# EAGLE design EFM-VCF-4622 (EAGLE 7.2.0)
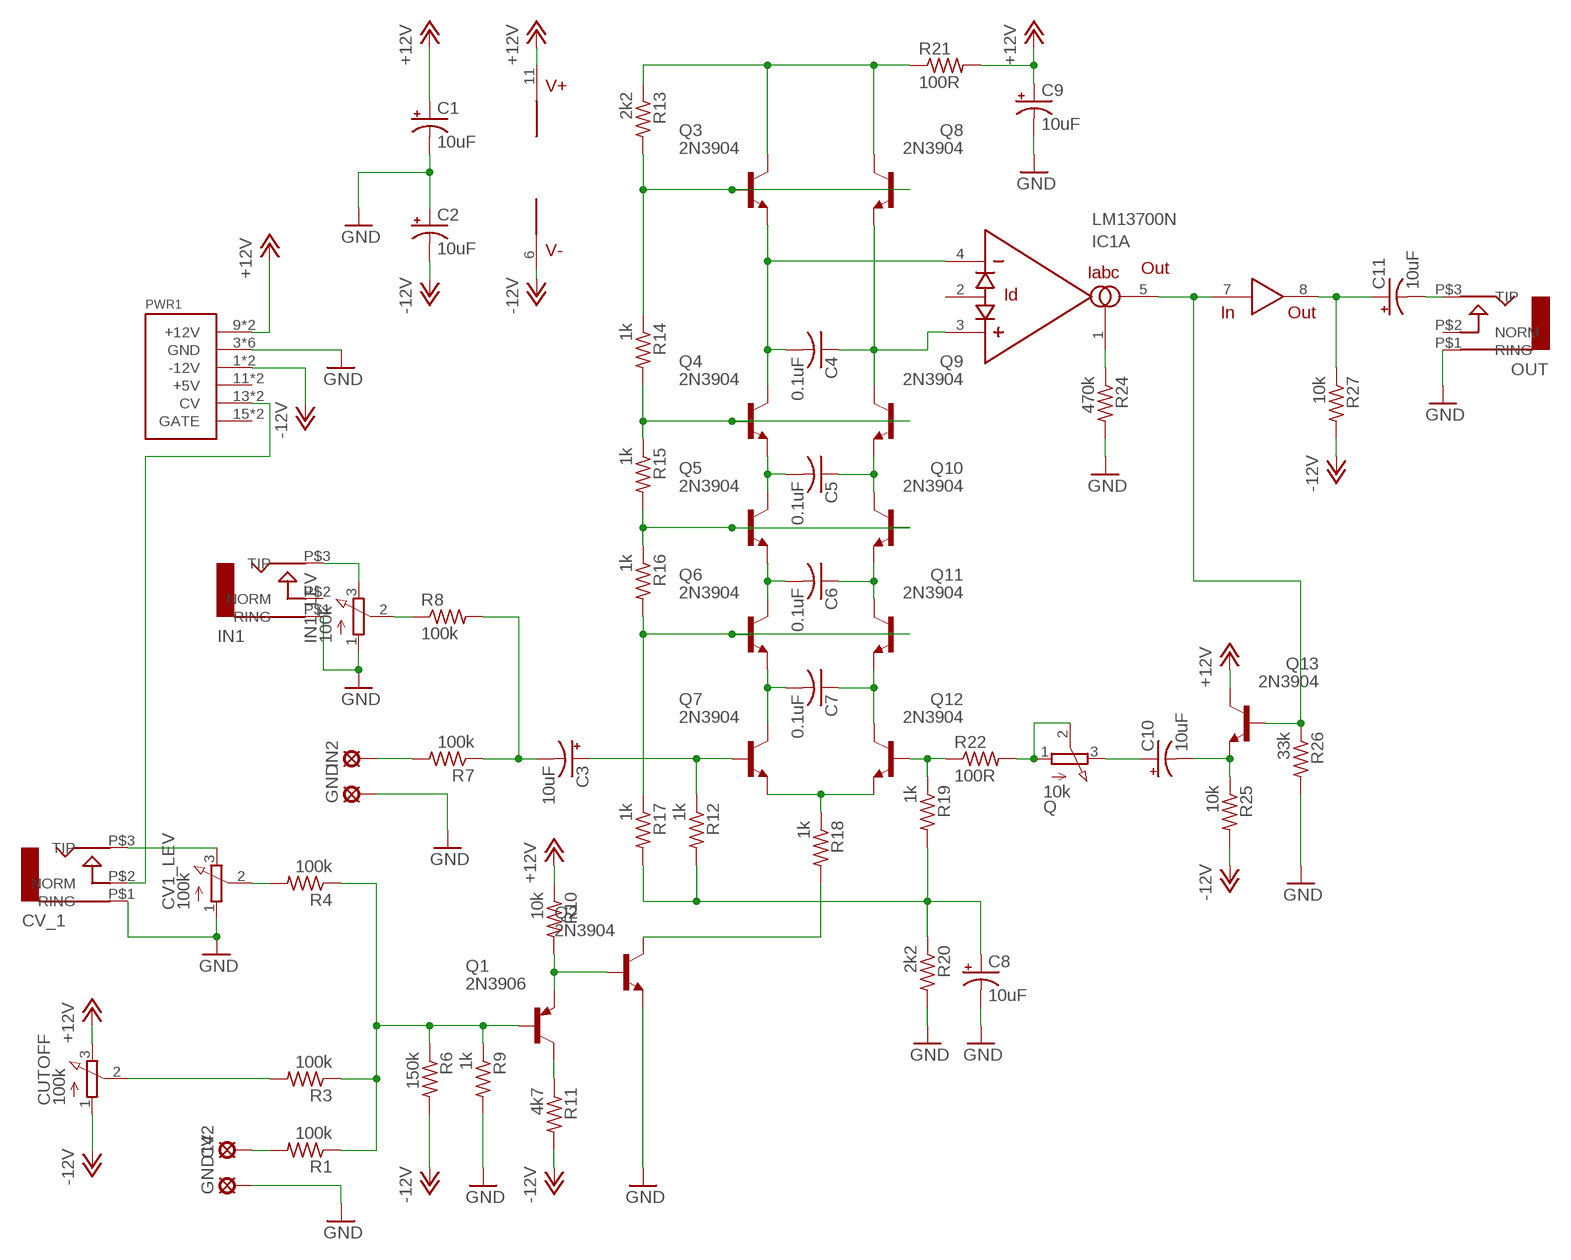
[diagram p0: schematic, sheet 1]

## Parts
C1  10uF  CPOL-USB45181A  [B45181A]
C2  10uF  CPOL-USB45181A  [B45181A]
C3  10uF  CPOL-USB45181A  [B45181A]
C4  0.1uF  C-US050-025X075  [C050-025X075]
C5  0.1uF  C-US050-025X075  [C050-025X075]
C6  0.1uF  C-US050-025X075  [C050-025X075]
C7  0.1uF  C-US050-025X075  [C050-025X075]
C8  10uF  CPOL-USB45181A  [B45181A]
C9  10uF  CPOL-USB45181A  [B45181A]
C10  10uF  CPOL-USB45181C  [B45181C]
C11  10uF  CPOL-USB45181B  [B45181B]
CUTOFF  100k  3RP/1610N  [3RP/1610N]
CV1_LEV  100k  3RP/1610N  [3RP/1610N]
CV2  LSP10  [LSP10]
CV_1  AUDIO-JACK  [ERTHENVAR-JACK-90DEG]
GND  LSP10  [LSP10]
GND14  LSP10  [LSP10]
IC1  LM13700N  [DIL16]
IN1  AUDIO-JACK  [ERTHENVAR-JACK-90DEG]
IN1_LEV  100k  3RP/1610N  [3RP/1610N]
IN2  LSP10  [LSP10]
OUT  AUDIO-JACK  [ERTHENVAR-JACK-90DEG]
PWR1  POWER  [POWER_16]
Q  10k  3RP/1610N  [3RP/1610N]
Q1  2N3906  [TO92]
Q2  2N3904  [TO92]
Q3  2N3904  [TO92]
Q4  2N3904  [TO92]
Q5  2N3904  [TO92]
Q6  2N3904  [TO92]
Q7  2N3904  [TO92]
Q8  2N3904  [TO92]
Q9  2N3904  [TO92]
Q10  2N3904  [TO92]
Q11  2N3904  [TO92]
Q12  2N3904  [TO92]
Q13  2N3904  [TO92]
R1  100k  R-US_0207/7  [0207/7]
R3  100k  R-US_0207/7  [0207/7]
R4  100k  R-US_0207/7  [0207/7]
R6  150k  R-US_0207/7  [0207/7]
R7  100k  R-US_0207/7  [0207/7]
R8  100k  R-US_0207/7  [0207/7]
R9  1k  R-US_0207/7  [0207/7]
R10  10k  R-US_0207/7  [0207/7]
R11  4k7  R-US_0207/7  [0207/7]
R12  1k  R-US_0207/7  [0207/7]
R13  2k2  R-US_0207/7  [0207/7]
R14  1k  R-US_0207/7  [0207/7]
R15  1k  R-US_0207/7  [0207/7]
R16  1k  R-US_0207/7  [0207/7]
R17  1k  R-US_0207/7  [0207/7]
R18  1k  R-US_0207/7  [0207/7]
R19  1k  R-US_0207/7  [0207/7]
R20  2k2  R-US_0207/7  [0207/7]
R21  100R  R-US_0207/7  [0207/7]
R22  100R  R-US_0207/7  [0207/7]
R24  470k  R-US_0207/7  [0207/7]
R25  10k  R-US_0207/7  [0207/7]
R26  33k  R-US_0207/7  [0207/7]
R27  10k  R-US_0207/7  [0207/7]

## Nets
+12V: C1.+ C9.+ CUTOFF.3(E) IC1.11(5:V+) PWR1.9(+12V) PWR1.10(+12V) Q13.1(C) R10.1 R21.2
-12V: C2.- CUTOFF.1(A) IC1.6(5:V-) PWR1.1(-12V) PWR1.2(-12V) R6.2 R11.2 R25.2 R27.2
GND: C1.- C2.+ C8.- C9.- CV1_LEV.1(A) CV_1.P$1(RING) GND14.MP GND.MP IN1.P$1(RING) IN1_LEV.1(A) OUT.P$1(RING) PWR1.3(GND) PWR1.4(GND) PWR1.5(GND) PWR1.6(GND) PWR1.7(GND) PWR1.8(GND) Q2.3(E) R9.2 R20.2 R24.2 R26.2
N$1: IC1.1(A:IABC) R24.1
N$2: Q.1(A) Q.2(S) R22.2
N$3: Q2.1(C) R18.2
N$4: Q7.3(E) Q12.3(E) R18.1
N$5: IN2.MP R7.2
N$6: C3.- R7.1 R8.2
N$7: C3.+ Q7.2(B) R12.1
N$8: Q1.3(E) Q2.2(B) R10.2
N$9: C4.2 IC1.4(A:-IN) Q3.3(E) Q4.1(C)
N$10: C10.+ Q.3(E)
N$11: CV2.MP R1.2
N$12: C4.1 IC1.3(A:+IN) Q8.3(E) Q9.1(C)
N$13: C6.1 Q10.3(E) Q11.1(C)
N$14: C5.2 Q4.3(E) Q5.1(C)
N$15: C5.1 Q9.3(E) Q10.1(C)
N$17: C7.1 Q11.3(E) Q12.1(C)
N$18: C7.2 Q6.3(E) Q7.1(C)
N$19: IC1.5(A:OUT) IC1.7(3:IN) Q13.2(B) R26.1
N$20: Q1.2(B) R1.1 R3.1 R4.1 R6.1 R9.1
N$25: C8.+ R12.2 R17.2 R19.2 R20.1
N$26: Q12.2(B) R19.1 R22.1
N$27: Q1.1(C) R11.1
N$28: C11.+ IC1.8(3:OUT) R27.1
N$29: C6.2 Q5.3(E) Q6.1(C)
N$31: C11.- OUT.P$3(TIP)
N$35: C10.- Q13.3(E) R25.1
N$43: Q3.1(C) Q8.1(C) R13.1 R21.1
N$44: Q3.2(B) Q8.2(B) R13.2 R14.1
N$46: Q4.2(B) Q9.2(B) R14.2 R15.1
N$49: Q5.2(B) Q10.2(B) R15.2 R16.1
N$50: Q6.2(B) Q11.2(B) R16.2 R17.1
N$53: CV1_LEV.2(S) R4.2
N$55: CV_1.P$2(NORM) PWR1.13(CV) PWR1.14(CV)
N$56: CUTOFF.2(S) R3.2
N$57: IN1_LEV.2(S) R8.1
N$58: IN1.P$3(TIP) IN1_LEV.3(E)
N$59: CV1_LEV.3(E) CV_1.P$3(TIP)
Unconnected: IC1.2(A:ID) IC1.9(4:OUT) IC1.10(4:IN) IC1.12(B:OUT) IC1.13(B:-IN) IC1.14(B:+IN) IC1.15(B:ID) IC1.16(B:IABC) IN1.P$2(NORM) OUT.P$2(NORM) PWR1.11(+5V) PWR1.12(+5V) PWR1.15(GATE) PWR1.16(GATE)

## Library data of the parts
C1-C3 C8-C11 = rcl:CPOL-US: POLARIZED CAPACITOR, American symbol
C4-C7 = rcl:C-US: CAPACITOR, American symbol
CUTOFF CV1_LEV IN1_LEV Q = pot:3RP/1610N: 16mm Potentiometer one level Source: http://www.alphapotentiometers.net/html/16mm_pot_2.html
CV2 GND GND14 IN2 = solpad:LSP10: SOLDER PAD drill 1.0 mm, distributor Buerklin, 12H555
CV_1 IN1 OUT = erthenvar:AUDIO-JACK: Switching Mono 3.5mm Audio Jack from Erthenvar.
IC1 = synthdiy updated imperial:LM13700: National Dual OTA with buffers.
PWR1 = eurorack:POWER
Q1 = transistor-pnp:2N3906: PNP Transistor
Q2-Q13 = transistor-npn:2N3904: NPN Transistor
R1 R3 R4 R6-R22 R24-R27 = rcl:R-US_: RESISTOR, American symbol

## Board
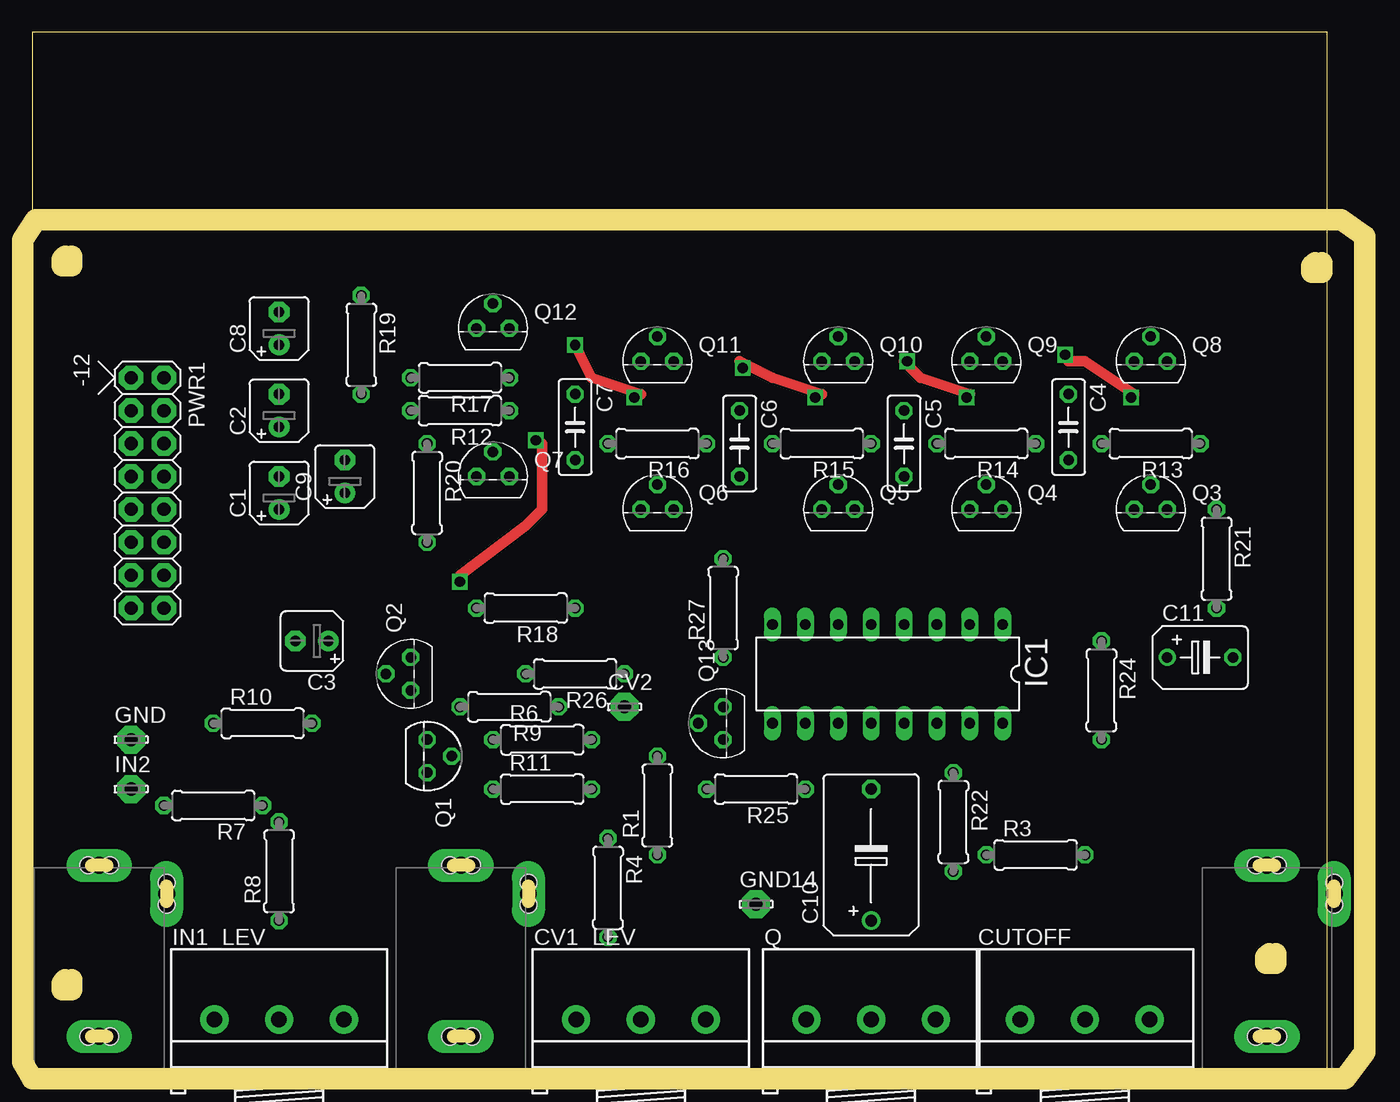
[diagram p1: board, top side]
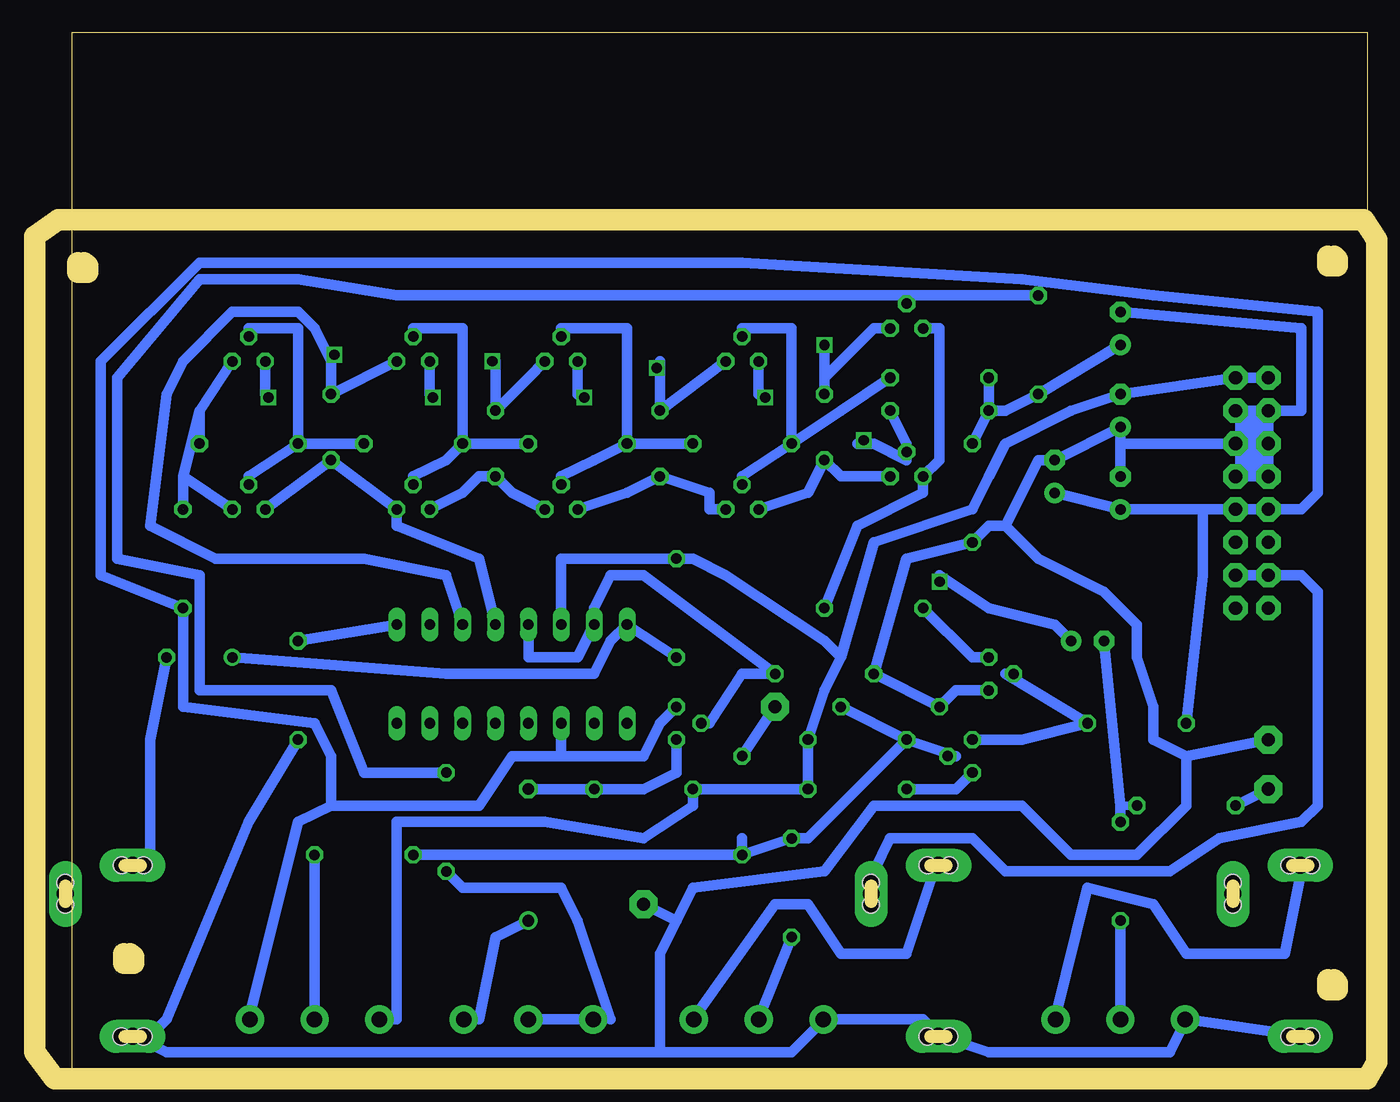
[diagram p2: board, bottom side, seen from below]

Size 100 x 80 mm. Coordinates in mm from the lower left corner, seen from the top.
Outline: 0,0 100,0 100,80 0,80 0,0
Copper layers (1*16): Top 0.035mm / dielectric 1.5mm / Bottom 0.035mm
Design rules "default *": minimum track width 26mil, minimum drill 31mil, track to track 16mil, track to pad 16mil, pad to pad 16mil, via to via 16mil, smd to smd 8mil, copper to edge 0mil, drill to drill 12mil, minimum pad ring 10mil, minimum via ring 8mil, stop-mask expansion 4mil, vias tented up to drill 0mil, thermal gap 10mil
Milling: 24 lines

### Footprints (pad centres in the part's own frame; a part is rotated, then mirrored left to right if it is on the bottom)
B45181A = drill 0.813 pad 1.6: + -1.27,0 | drill 0.813 pad 1.6 octagon: - 1.27,0
C050-025X075 = drill 0.813 octagon: 1 -2.54,0; 2 2.54,0
B45181C = drill 0.914: + -5.08,0 | drill 0.914 octagon: - 5.08,0
B45181B = drill 0.813: + -2.54,0 | drill 0.813 octagon: - 2.54,0
3RP/1610N = drill 1.2 pad 2.184: 1 -5,0; 2 0,0; 3 5,0
LSP10 = drill 1.016 pad 2.159 octagon: MP 0,0
ERTHENVAR-JACK-90DEG = drill 1.3 pad 2.54 long: P$1 5,-2.5; P$2 -0.2,-13.5; P$3 5,-15.7 | hole 1.3: 5.842,-2.489; 4.14,-2.489; -0.203,-12.649; -0.203,-14.351; 5.842,-15.697; 4.166,-15.697
DIL16 = drill 0.813 long: 1 -8.89,-3.81; 2 -6.35,-3.81; 3 -3.81,-3.81; 4 -1.27,-3.81; 5 1.27,-3.81; 6 3.81,-3.81; 7 6.35,-3.81; 8 8.89,-3.81; 9 8.89,3.81; 10 6.35,3.81; 11 3.81,3.81; 12 1.27,3.81; 13 -1.27,3.81; 14 -3.81,3.81; 15 -6.35,3.81; 16 -8.89,3.81
POWER_16 = drill 1.016 pad 1.88 octagon: 1 -6.35,-1.27; 2 -6.35,1.27; 3 -3.81,-1.27; 4 -3.81,1.27; 5 -1.27,-1.27; 6 -1.27,1.27; 7 1.27,-1.27; 8 1.27,1.27; 9 3.81,-1.27; 10 3.81,1.27; 11 6.35,-1.27; 12 6.35,1.27; 13 8.89,-1.27; 14 8.89,1.27; 15 11.43,-1.27; 16 11.43,1.27
TO92 = drill 0.813 octagon: 1 1.27,0; 2 0,1.905; 3 -1.27,0
0207/7 = drill 0.813 octagon: 1 -3.81,0; 2 3.81,0

### Placement (x,y rotation side)
C1  19.05,44.45 90 top
C2  19.05,50.8 90 top
C3  21.59,33.02 180 top
C4  80.01,49.53 270 top
C5  67.31,48.26 270 top
C6  54.61,48.26 270 top
C7  41.91,49.53 270 top
C8  19.05,57.15 90 top
C9  24.13,45.72 90 top
C10  64.77,16.51 90 top
C11  90.17,31.75 0 top
CUTOFF  81.28,3.81 0 top
CV1_LEV  46.99,3.81 0 top
CV2  45.72,27.94 0 top
CV_1  38.1,0 180 top
GND  7.62,25.4 0 top
GND14  55.88,12.7 0 top
IC1  66.04,30.48 180 top
IN1  10.16,0 180 top
IN1_LEV  19.05,3.81 0 top
IN2  7.62,21.59 0 top
OUT  100.33,0 180 top
PWR1  8.89,46.99 270 top
Q  64.77,3.81 0 top
Q1  30.48,24.13 270 top
Q2  29.21,30.48 90 top
Q3  86.36,43.18 0 top
Q4  73.66,43.18 0 top
Q5  62.23,43.18 0 top
Q6  48.26,43.18 0 top
Q7  35.56,45.72 0 top
Q8  86.36,54.61 0 top
Q9  73.66,54.61 0 top
Q10  62.23,54.61 0 top
Q11  48.26,54.61 0 top
Q12  35.56,57.15 0 top
Q13  53.34,26.67 90 top
R1  48.26,20.32 90 top
R3  77.47,16.51 0 top
R4  44.45,13.97 270 top
R6  39.37,25.4 0 top
R7  13.97,20.32 180 top
R8  19.05,15.24 90 top
R9  36.83,27.94 180 top
R10  17.78,26.67 0 top
R11  39.37,21.59 0 top
R12  33.02,50.8 180 top
R13  86.36,48.26 180 top
R14  73.66,48.26 180 top
R15  60.96,48.26 180 top
R16  48.26,48.26 180 top
R17  33.02,53.34 180 top
R18  38.1,35.56 180 top
R19  25.4,55.88 270 top
R20  30.48,44.45 270 top
R21  91.44,39.37 270 top
R22  71.12,19.05 270 top
R24  82.55,29.21 270 top
R25  55.88,21.59 180 top
R26  41.91,30.48 180 top
R27  53.34,35.56 90 top

### Tracks (layer width: path | path; a pad name or v marks a point on that pad's centre or on a via)
+12V
  Bottom 0.813: 12.7,43.18 PWR1.10 PWR1.9 5.08,43.18 3.81,44.45 3.81,58.42 16.51,59.69 26.67,60.96 48.26,62.23 90.17,62.23 97.79,54.61 97.79,38.1 R21.2 91.44,27.94 81.28,26.67 80.01,24.13 80.01,20.32 | 12.7,43.18 12.7,38.1 R10.1 | 12.7,43.18 C1.+ C9.+ | 86.36,3.81 82.55,19.05 80.01,20.32 | 80.01,20.32 77.47,20.32 73.66,20.32 71.12,20.32 68.58,20.32 66.04,24.13 62.23,24.13 | 62.23,24.13 IC1.11 | Q13.1 54.61,26.67 55.88,24.13 62.23,24.13
-12V
  Bottom 0.813: PWR1.1 PWR1.2 C2.- 22.86,50.8 27.94,48.26 29.21,45.72 30.48,43.18 38.1,40.64 40.64,31.75 | R11.2 R6.2 41.91,29.21 40.64,31.75 | R11.2 R25.2 52.07,20.32 55.88,17.78 63.5,19.05 66.04,19.05 74.93,19.05 74.93,17.78 74.93,3.81 | R11.2 | 40.64,31.75 41.91,33.02 49.53,38.1 52.07,39.37 R27.2 62.23,39.37 IC1.6 | 74.93,3.81 | 74.93,3.81 | 74.93,3.81 76.2,3.81
GND
  Bottom 0.66: 13.97,3.81 | 41.91,3.81
  Bottom 0.813: 19.05,48.26 C2.+ C9.- 25.4,46.99 27.94,41.91 | 19.05,48.26 C1.- | PWR1.5 PWR1.7 PWR1.8 | PWR1.5 PWR1.6 19.05,48.26 | C8.- 5.08,57.15 5.08,50.8 PWR1.3 | PWR1.3 PWR1.4 | PWR1.3 PWR1.5 | 13.97,24.13 16.51,25.4 16.51,27.94 17.78,31.75 17.78,34.29 20.32,36.83 25.4,39.37 26.67,40.64 27.94,41.91 | 13.97,24.13 | 27.94,41.91 29.21,41.91 R20.2 35.56,39.37 | 54.61,1.27 44.45,1.27 41.91,3.81 34.29,3.81 33.02,2.54 | 54.61,1.27 77.47,1.27 | 5.08,2.54 13.97,3.81 15.24,1.27 21.59,1.27 29.21,1.27 33.02,2.54 | 5.08,2.54 | 35.56,39.37 R26.2 R9.2 31.75,29.21 Q2.3 | 35.56,39.37 | 77.47,1.27 92.71,1.27 95.25,2.54 93.98,2.54 92.71,3.81 86.36,19.05 R24.2 | 13.97,24.13 13.97,20.32 17.78,16.51 22.86,16.51 26.67,20.32 38.1,20.32 41.91,15.24 52.07,13.97 53.34,11.43 | 53.34,11.43 54.61,8.89 54.61,1.27 | 33.02,2.54 | 77.47,1.27 | GND.MP 13.97,24.13 | 13.97,24.13 | GND14.MP | GND14.MP 53.34,11.43
N$1
  Bottom 0.813: R24.1 IC1.1
N$2
  Bottom 0.66: 58.42,3.81 59.69,3.81
  Bottom 0.813: 59.69,3.81 Q.2 | 58.42,3.81 60.96,11.43 62.23,13.97 64.77,13.97 69.85,13.97 R22.2
N$3
  Bottom 0.813: Q2.1 30.48,31.75 R18.2
N$4
  Bottom 0.813: Q12.3 | Q12.3 33.02,57.15 33.02,53.34 33.02,50.8 33.02,46.99 Q7.3 34.29,44.45 39.37,41.91 R18.1
N$5
  Bottom 0.813: IN2.MP R7.2
N$6
  Bottom 0.66: 19.05,20.32 R7.1
  Bottom 0.813: C3.- 19.05,20.32 R8.2
N$7  (via drill 0.8 pad 0.81)
  Top 0.813: 33.02,38.1 | 33.02,38.1 38.1,41.91 39.37,43.18 39.37,48.26
  Bottom 0.813: 35.56,48.26 R12.1 | 35.56,46.99 | 35.56,46.99 35.56,48.26 | 35.56,48.26 35.56,46.99 | C3.+ 24.13,34.29 29.21,35.56 33.02,38.1 | 39.37,48.26 38.1,48.26 35.56,46.99
  other vias: 33.02,37.59 38.86,48.51
N$8
  Bottom 0.813: Q1.3 | Q1.3 26.67,25.4 R10.2 27.94,30.48
N$9
  Bottom 0.813: IC1.4 68.58,39.37 74.93,41.91 Q4.1 | C4.2 | C4.2 Q3.3 | Q4.1 | Q4.1 C4.2
N$10
  Bottom 0.66: 68.58,3.81 69.85,3.81
  Bottom 0.813: C10.+ 67.31,10.16 68.58,3.81
N$11
  Bottom 0.813: R1.2 CV2.MP
N$12  (via drill 0.8)
  Top 0.813: 80.01,54.61 81.28,54.61 85.09,52.07
  Bottom 0.813: Q9.1 | Q9.1 C4.1 | C4.1 | C4.1 80.01,54.61 81.28,57.15 82.55,58.42 87.63,58.42 91.44,54.61 92.71,52.07 93.98,41.91 88.9,39.37 77.47,39.37 71.12,38.1 IC1.3 | 85.09,52.07 Q8.3
  other vias: 79.76,55.12 84.84,51.82
N$13  (via drill 0.8)
  Top 0.813: 54.61,54.61 57.15,53.34 60.96,52.07
  Bottom 0.813: Q11.1 | Q11.1 C6.1 54.61,54.61 | 60.96,52.07 Q10.3 | Q10.3
  other vias: 54.86,54.1 60.45,51.82
N$14
  Bottom 0.66: Q5.1
  Bottom 0.813: Q5.1 | Q5.1 66.04,44.45 C5.2 68.58,45.72 69.85,44.45 Q4.3
N$15  (via drill 0.8)
  Top 0.813: 67.31,54.61 68.58,53.34 72.39,52.07
  Bottom 0.813: Q10.1 64.77,53.34 C5.1 | C5.1 | C5.1 67.31,54.61 | 72.39,52.07 Q9.3
  other vias: 67.56,54.61 72.14,51.82
N$17  (via drill 0.8)
  Top 0.813: v41.91,55.88 43.18,53.34 46.99,52.07
  Bottom 0.813: Q12.1 38.1,57.15 41.91,53.34 C7.1 v41.91,55.88 | 46.99,52.07 Q11.3 | Q11.3
  other vias: 46.48,51.82
N$18
  Bottom 0.66: C7.2
  Bottom 0.813: Q7.1 38.1,45.72 40.64,45.72 C7.2 | C7.2 | Q6.3 43.18,44.45 C7.2
N$19
  Bottom 0.66: IC1.7 59.69,35.56 | IC1.5 | IC1.5 | IC1.7
  Bottom 0.813: 59.69,35.56 58.42,38.1 55.88,38.1 R26.1 48.26,30.48 50.8,26.67 | IC1.5 64.77,31.75 60.96,31.75 IC1.7
N$20
  Bottom 0.813: R6.1 R9.1 | 36.83,24.13 43.18,17.78 R4.1 R1.1 | R1.1 55.88,16.51 62.23,16.51 67.31,16.51 R3.1 | R1.1 48.26,17.78 R1.1 | 36.83,24.13 | 36.83,24.13 R6.1 | 31.75,24.13 | 31.75,24.13 R6.1
N$25
  Bottom 0.813: R20.1 R12.2 | C8.+ R19.2 27.94,50.8 R12.2 | R12.2 R17.2
N$26
  Bottom 0.813: 35.56,59.69 | 35.56,59.69 38.1,59.69 49.53,59.69 74.93,59.69 82.55,60.96 90.17,60.96 96.52,53.34 96.52,39.37 90.17,38.1 90.17,35.56 90.17,29.21 80.01,29.21 77.47,22.86 R22.1 | R19.1 35.56,59.69 | 35.56,59.69
N$27
  Bottom 0.813: Q1.1 | 31.75,21.59 34.29,21.59 R11.1 | 31.75,21.59 | 31.75,21.59 Q1.1
N$28
  Bottom 0.813: R27.1 IC1.8 58.42,33.02 59.69,30.48 71.12,30.48 C11.+
N$29
  Bottom 0.813: Q6.1 50.8,43.18 50.8,44.45 C6.2 | C6.2 57.15,44.45 Q5.3 | C6.2 | Q5.3
N$31
  Bottom 0.813: C11.- 93.98,25.4 93.98,15.24 95.25,15.24
N$35
  Bottom 0.813: C10.- R25.1 58.42,21.59 55.88,21.59 53.34,22.86 Q13.3
N$43  (1 unrouted)
  Bottom 0.813: R21.1 | Q8.1 90.17,50.8 | 90.17,50.8 91.44,45.72 | 91.44,45.72 R21.1 | Q3.1 91.44,45.72 | 90.17,50.8 R13.1
N$44
  Bottom 0.813: R14.1 80.01,48.26 R13.2 | R13.2 86.36,45.72 | R13.2 | R13.2 82.55,57.15 83.82,57.15 86.36,57.15
N$46
  Bottom 0.813: R15.1 R14.2 | R14.2 | R14.2 69.85,53.34 69.85,54.61 69.85,57.15 72.39,57.15 73.66,57.15 | R14.2 71.12,46.99 73.66,45.72
N$49
  Bottom 0.813: R15.2 R16.1 | 62.23,45.72 | 62.23,45.72 59.69,46.99 R15.2 | R15.2 57.15,57.15 60.96,57.15 62.23,57.15
N$50
  Bottom 0.813: 48.26,45.72 | 48.26,45.72 R16.2 | R16.2 44.45,57.15 46.99,57.15 48.26,57.15 | R17.1 | R17.1 40.64,50.8 R16.2
N$53
  Bottom 0.813: CV1_LEV.2 R4.2
N$55
  Bottom 0.66: PWR1.14 PWR1.13
  Bottom 0.813: PWR1.14 5.08,38.1 3.81,36.83 3.81,20.32 5.08,19.05 11.43,17.78 15.24,15.24 27.94,15.24 30.48,17.78 36.83,17.78 38.1,15.24 38.1,13.97
N$56
  Bottom 0.813: CUTOFF.2 R3.2
N$57
  Bottom 0.813: IN1_LEV.2 R8.1
N$58
  Bottom 0.813: 5.08,15.24 6.35,8.89 13.97,8.89 16.51,12.7 21.59,13.97 24.13,3.81 | 24.13,3.81
N$59
  Bottom 0.813: 33.02,15.24 33.02,16.51 35.56,8.89 40.64,8.89 43.18,12.7 45.72,12.7 52.07,3.81 | 52.07,3.81
(copper drawn outside any net)
  shapes: Bottom area x1